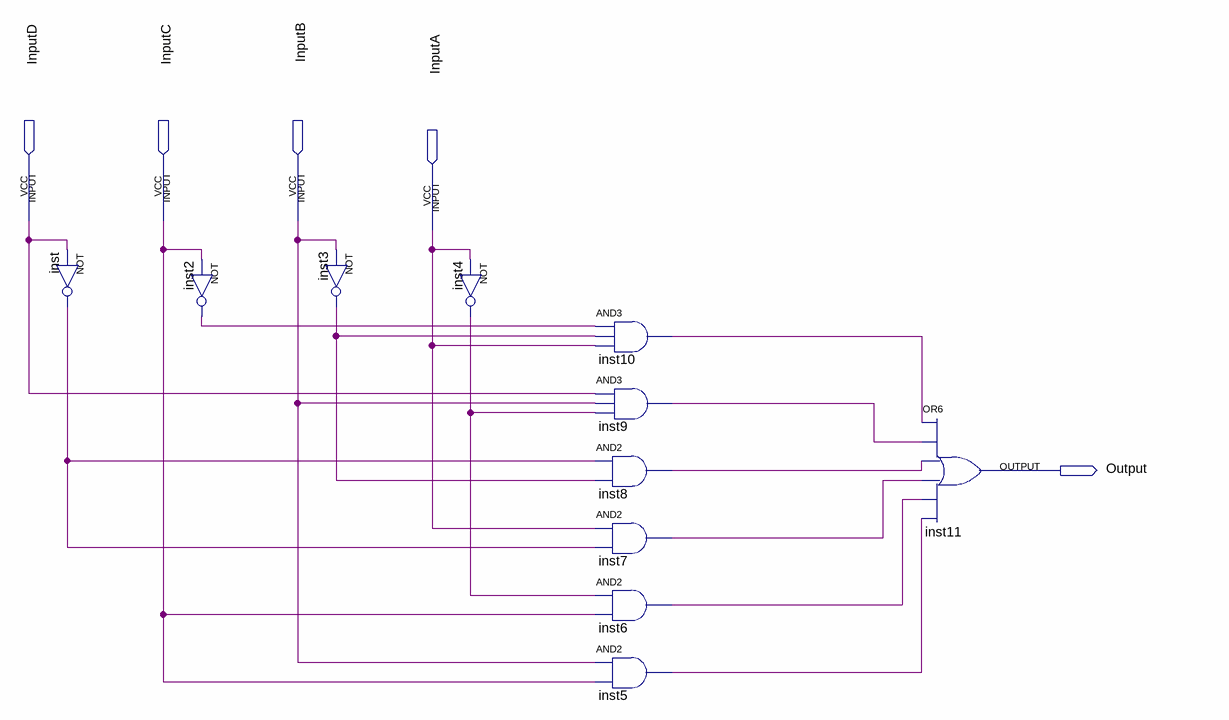
[diagram p0: schematic sheet]
// Quartus schematic SegA.bdf as structural Verilog: 11 symbols, 5 pins
module SegA (
  input  InputD,
  input  InputC,
  input  InputB,
  input  InputA,
  output Output
);

  wire inst2_out, inst3_out, inst4_out, inst5_out, inst6_out, inst7_out, inst8_out, inst9_out, inst10_out,
       inst_out;

  not inst (inst_out, InputD);
  not inst2 (inst2_out, InputC);
  not inst3 (inst3_out, InputB);
  not inst4 (inst4_out, InputA);
  and inst10 (inst10_out, inst2_out, inst3_out, InputA);
  and inst9 (inst9_out, InputD, InputB, inst4_out);
  and inst8 (inst8_out, inst_out, inst3_out);
  and inst7 (inst7_out, InputA, inst_out);
  and inst6 (inst6_out, inst4_out, InputC);
  and inst5 (inst5_out, InputB, InputC);
  or inst11 (Output, inst10_out, inst9_out, inst8_out, inst7_out, inst6_out, inst5_out);
endmodule
